# EAGLE schematic weathervane_public (EAGLE 6.2)
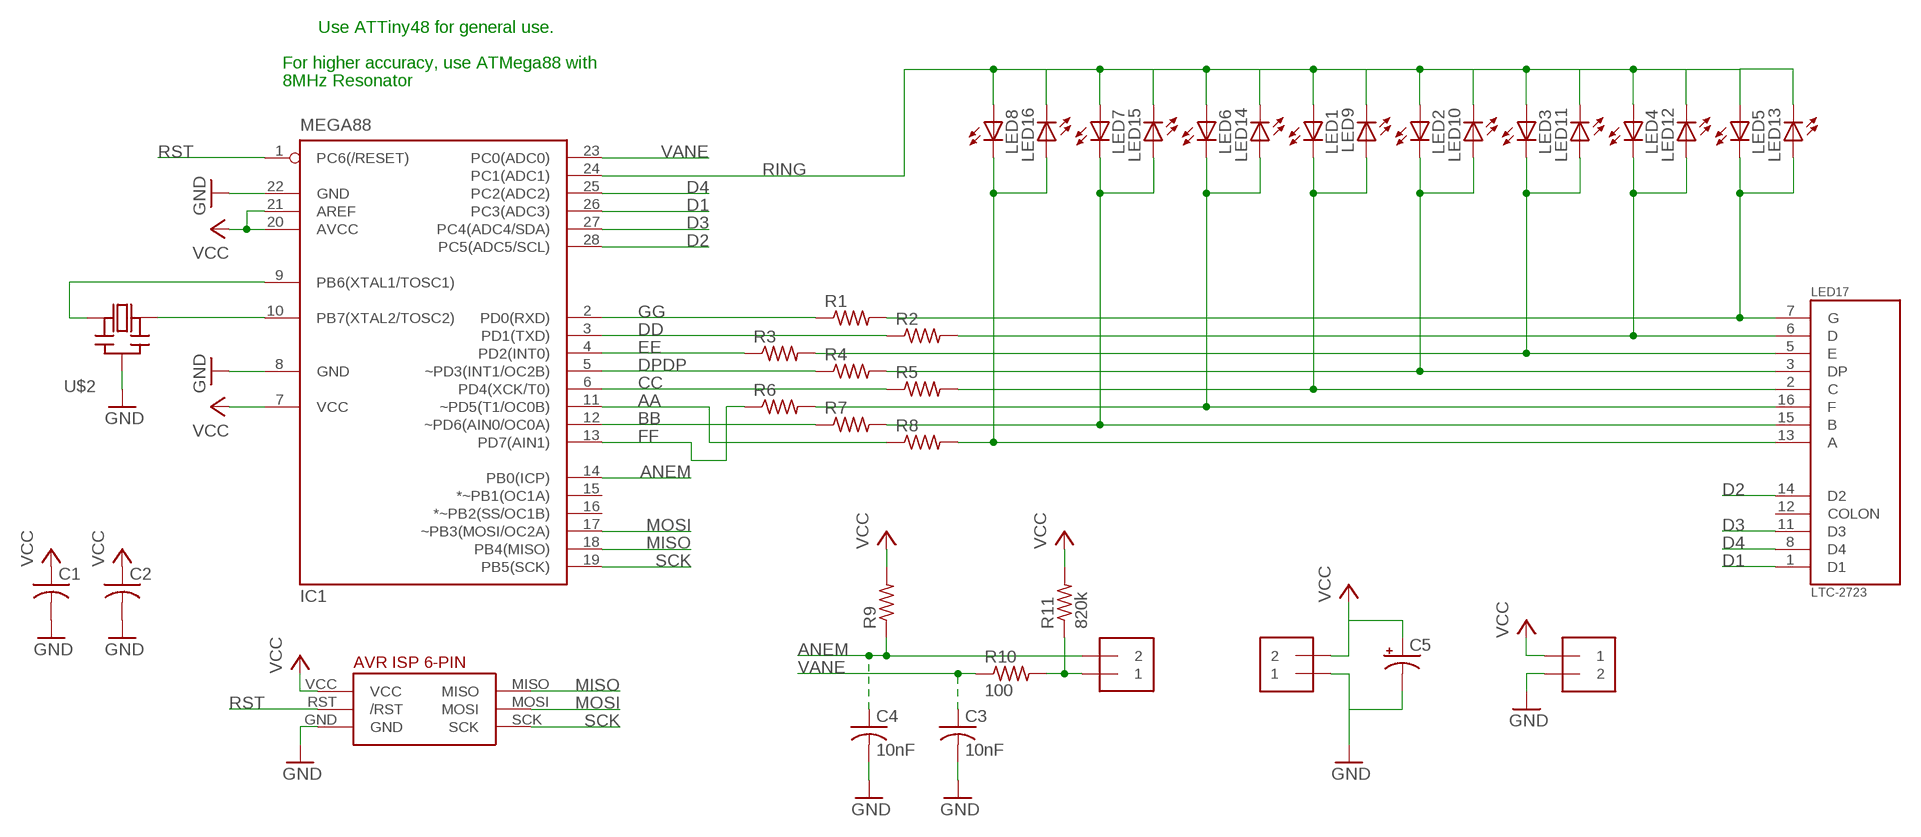
[diagram p0: schematic, sheet 1]

## Parts
C1  C025_050X025  [C025_050X025]
C2  C025_050X025  [C025_050X025]
C3  10nF  C025_050X025  [C025_050X025]
C4  10nF  C025_050X025  [C025_050X025]
C5  C_POL2.5-6  [E25-6]
IC1  MEGA88  MEGA8-P  [DIL28-3]
J1  1X2-3.5MM  [1X2-3.5MM]
J2  1X2-3.5MM  [1X2-3.5MM]
J3  1X2-3.5MM  [1X2-3.5MM]
LED1  LED5MM  [LED5MM]
LED2  LED5MM  [LED5MM]
LED3  LED5MM  [LED5MM]
LED4  LED5MM  [LED5MM]
LED5  LED5MM  [LED5MM]
LED6  LED5MM  [LED5MM]
LED7  LED5MM  [LED5MM]
LED8  LED5MM  [LED5MM]
LED9  LED5MM  [LED5MM]
LED10  LED5MM  [LED5MM]
LED11  LED5MM  [LED5MM]
LED12  LED5MM  [LED5MM]
LED13  LED5MM  [LED5MM]
LED14  LED5MM  [LED5MM]
LED15  LED5MM  [LED5MM]
LED16  LED5MM  [LED5MM]
LED17  LTC-2723  [LTC-2723]
R1  R207/7  [R_207/7]
R2  R207/7  [R_207/7]
R3  R207/7  [R_207/7]
R4  R207/7  [R_207/7]
R5  R207/7  [R_207/7]
R6  R207/7  [R_207/7]
R7  R207/7  [R_207/7]
R8  R207/7  [R_207/7]
R9  R207/7  [R_207/7]
R10  100  R207/7  [R_207/7]
R11  820k  R207/7  [R_207/7]
U$1  AVR_ISP  [AVR_ISP6]
U$2  CERMOSCILL-THM  [CERM_OSC]

## Nets
A: LED8.K(C) LED16.A LED17.13(A) R8.2
AA: IC1.11(~PD5(T1/OC0B)) R8.1
ANEM: C4.1 IC1.14(PB0(ICP)) J1.2 R9.1
B: LED7.K(C) LED15.A LED17.15(B) R7.2
BB: IC1.12(~PD6(AIN0/OC0A)) R7.1
C: LED1.K(C) LED9.A LED17.2(C) R5.2
CC: IC1.6(PD4(XCK/T0)) R5.1
D: LED4.K(C) LED12.A LED17.6(D) R2.2
D1: IC1.26(PC3(ADC3)) LED17.1(D1)
D2: IC1.28(PC5(ADC5/SCL)) LED17.14(D2)
D3: IC1.27(PC4(ADC4/SDA)) LED17.11(D3)
D4: IC1.25(PC2(ADC2)) LED17.8(D4)
DD: IC1.3(PD1(TXD)) R2.1
DP: LED2.K(C) LED10.A LED17.3(DP) R4.2
DPDP: IC1.5(~PD3(INT1/OC2B)) R4.1
E: LED3.K(C) LED11.A LED17.5(E) R3.2
EE: IC1.4(PD2(INT0)) R3.1
F: LED6.K(C) LED14.A LED17.16(F) R6.2
FF: IC1.13(PD7(AIN1)) R6.1
G: LED5.K(C) LED13.A LED17.7(G) R1.2
GG: IC1.2(PD0(RXD)) R1.1
GND: C1.2 C2.2 C3.2 C4.2 C5.- IC1.8(GND) IC1.22(GND) J2.2 J3.1 U$1.GND U$2.P$2(GND)
MISO: IC1.18(PB4(MISO)) U$1.MISO
MOSI: IC1.17(~PB3(MOSI/OC2A)) U$1.MOSI
N$17: IC1.10(PB7(XTAL2/TOSC2)) U$2.P$3(OUT)
N$18: IC1.9(PB6(XTAL1/TOSC1)) U$2.P$1(IN)
N$19: J1.1 R10.2 R11.1
RING: IC1.24(PC1(ADC1)) LED1.A LED2.A LED3.A LED4.A LED5.A LED6.A LED7.A LED8.A LED9.K(C) LED10.K(C) LED11.K(C) LED12.K(C) LED13.K(C) LED14.K(C) LED15.K(C) LED16.K(C)
RST: IC1.1(PC6(/RESET)) U$1.RST(/RST)
SCK: IC1.19(PB5(SCK)) U$1.SCK
VANE: C3.1 IC1.23(PC0(ADC0)) R10.1
VCC: C1.1 C2.1 C5.+ IC1.7(VCC) IC1.20(AVCC) IC1.21(AREF) J2.1 J3.2 R9.2 R11.2 U$1.VCC
Unconnected: IC1.15(*~PB1(OC1A)) IC1.16(*~PB2(SS/OC1B)) LED17.12(COLON)

## Notes on the sheet
- Use ATTiny48 for general use.
- For higher accuracy, use ATMega88 with
- 8MHz Resonator

## Library data of the parts
C1-C4 = DIYPCB:C
C5 = DIYPCB:C_POL
IC1 = atmel:MEGA8-P: MICROCONTROLLER 8 Kbytes FLASH, 1 kbytes SRAM, 512 bytes EEPROM, USART, 4-channel 10 bit ADC, 2-channel 8 bit ADC Pin compatible with Atmega48, ATMega88, ATMega168 Source: avr.lbr; OC_FARNELL: unknown; OC_NEWARK: unknown
J1-J3 = adafruit:1X2: 3.5mm Terminal block http://www.ladyada.net/library/pcb/eaglelibrary.html
LED1-LED16 = led:LED: LED OSRAM: - CHIPLED LG R971, LG N971, LY N971, LG Q971, LY Q971, LO R971, LY R971 LH N974, LH R974 LS Q976, LO Q976, LY Q976 LO Q996 - Hyper CHIPLED LW Q18S LB Q993, LB Q99A, LB R99A - SideLED LS A670, LO A670, LY A670, LG A670, LP A670 LB A673, LV A673, LT A673, LW A673 LH A674 LY A675 LS A676, LA A676, LO A676, LY A676, LW A676 LS A679, LY A679, LG A679 - Hyper Micro SIDELED® LS Y876, LA Y876, LO Y876, LY Y876 LT Y87S - SmartLED LW L88C, LW L88S LB L89C, LB L89S, LG L890 LS L89K, LO L89K, LY L89K LS L896, LA L896, LO L896, LY L896 - TOPLED LS T670, LO T670, LY T670, LG T670, LP T670 LSG T670, LSP T670, LSY T670, LOP T670, LYG T670 LG T671, LOG T671, LSG T671 LB T673, LV T673, LT T673, LW T673 LH T674 LS T676, LA T676, LO T676, LY T676, LB T676, LH T676, LSB T676, LW T676 LB T67C, LV T67C, LT T67C, LS T67K, LO T67K, LY T67K, LW E67C LS E67B, LA E67B, LO E67B, LY E67B, LB E67C, LV E67C, LT E67C LW T67C LS T679, LY T679, LG T679 LS T770, LO T770, LY T770, LG T770, LP T770 LB T773, LV T773, LT T773, LW T773 LH T774 LS E675, LA E675, LY E675, LS T675 LS T776, LA T776, LO T776, LY T776, LB T776 LHGB T686 LT T68C, LB T68C - Hyper Mini TOPLED® LB M676 - Mini TOPLED Santana® LG M470 LS M47K, LO M47K, LY M47K Source: http://www.osram.convergy.de LUXEON: - LUMILED® LXK2-PW12-R00, LXK2-PW12-S00, LXK2-PW14-U00, LXK2-PW14-V00 LXK2-PM12-R00, LXK2-PM12-S00, LXK2-PM14-U00 LXK2-PE12-Q00, LXK2-PE12-R00, LXK2-PE12-S00, LXK2-PE14-T00, LXK2-PE14-U00 LXK2-PB12-K00, LXK2-PB12-L00, LXK2-PB12-M00, LXK2-PB14-N00, LXK2-PB14-P00, LXK2-PB14-Q00 LXK2-PR12-L00, LXK2-PR12-M00, LXK2-PR14-Q00, LXK2-PR14-R00 LXK2-PD12-Q00, LXK2-PD12-R00, LXK2-PD12-S00 LXK2-PH12-R00, LXK2-PH12-S00 LXK2-PL12-P00, LXK2-PL12-Q00, LXK2-PL12-R00 Source: www.luxeon.com KINGBRIGHT: KA-3528ASYC Source: www.kingbright.com
LED17 = jmd_lappy:LTC-2723
R1-R11 = DIYPCB:R
U$1 = jmd.rpt:AVR_ISP
U$2 = adafruit:CERMOSCILL: Ceramic oscillator with built in capacitors such as ZTT-12MHz http://www.ladyada.net/library/eagle